# Altium project 584689669.PrjPcb
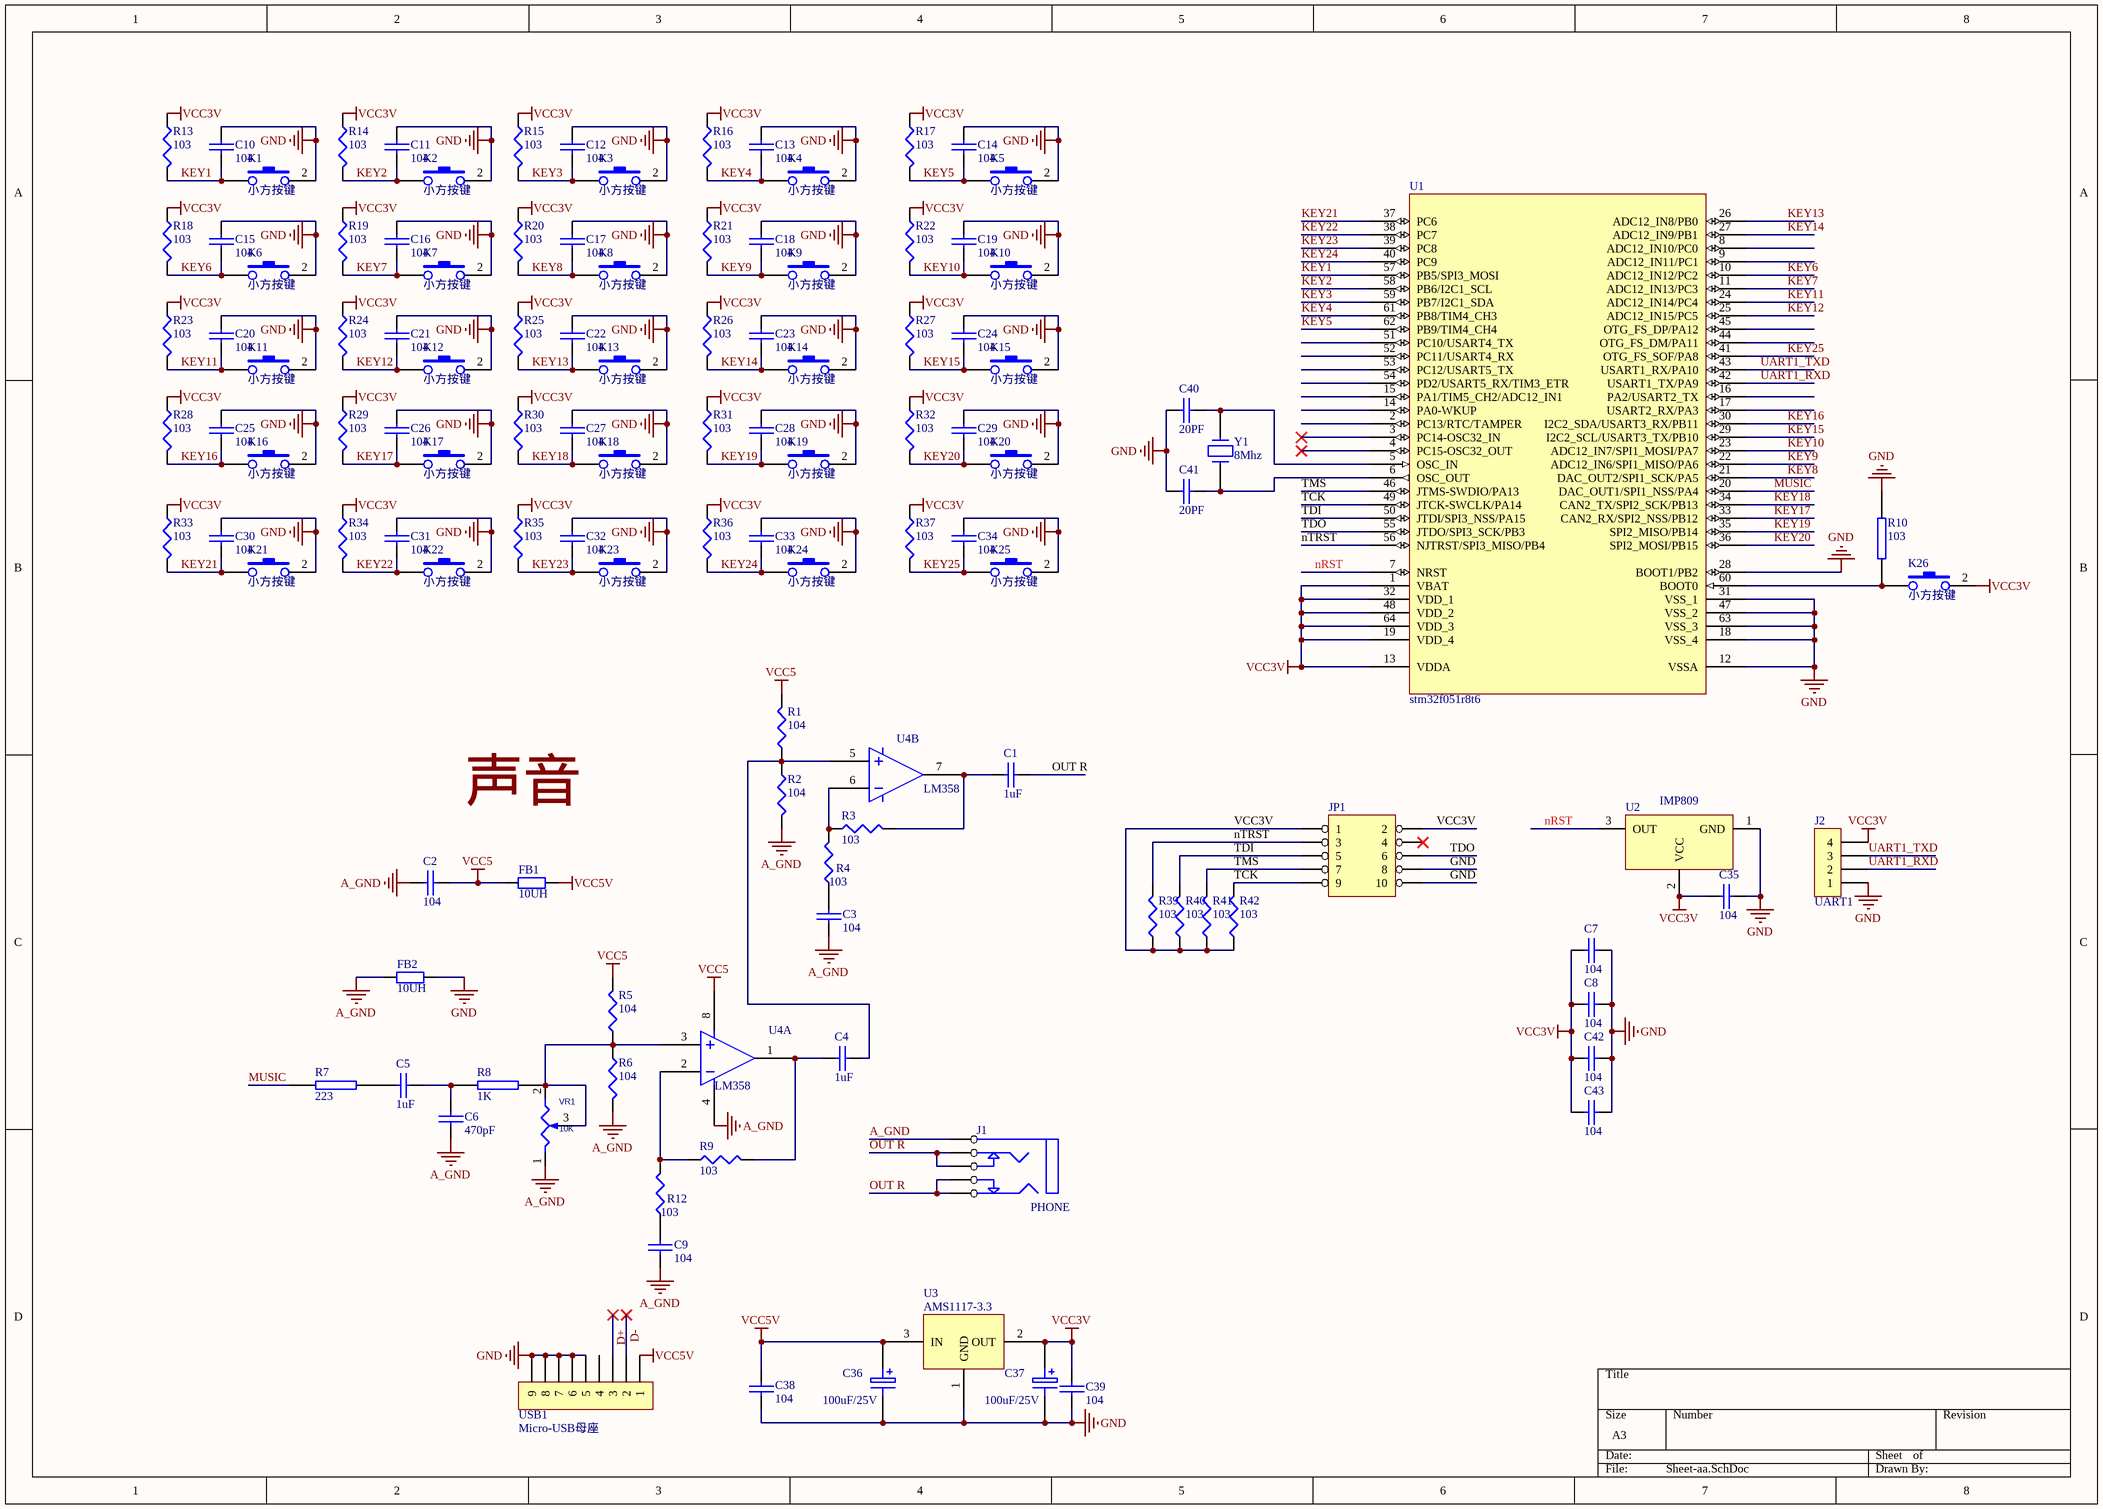
[diagram p0: Sheet-aa.SchDoc]
1 sheet, 121 parts. Net scope: global (net labels, ports and power ports of the same name join across sheets).
Board file: 584689669.PcbDoc

## Sheet Sheet-aa.SchDoc
size A3

### Parts
C1  1uF  [0805C]
C2  104  [0805C]
C3  104  [0805C]
C4  1uF  [0805C]
C5  1uF  [0805C]
C6  470pF  [0805C]
C7  104  [0805C]
C8  104  [0805C]
C9  104  [0805C]
C10  104  [0805C]
C11  104  [0805C]
C12  104  [0805C]
C13  104  [0805C]
C14  104  [0805C]
C15  104  [0805C]
C16  104  [0805C]
C17  104  [0805C]
C18  104  [0805C]
C19  104  [0805C]
C20  104  [0805C]
C21  104  [0805C]
C22  104  [0805C]
C23  104  [0805C]
C24  104  [0805C]
C25  104  [0805C]
C26  104  [0805C]
C27  104  [0805C]
C28  104  [0805C]
C29  104  [0805C]
C30  104  [0805C]
C31  104  [0805C]
C32  104  [0805C]
C33  104  [0805C]
C34  104  [0805C]
C35  104  [0805C]
C36  100uF/25V  [1016V]
C37  100uF/25V  [1016V]
C38  104  [0805C]
C39  104  [0805C]
C40  20PF  [0805C]
C41  20PF  [0805C]
C42  104  [0805C]
C43  104  [0805C]
FB1  value 10UH  [0805]  (hidden comment: Res2)
FB2  value 10UH  [0805]  (hidden comment: Res2)
J1  PHONE  [SOUND-2]
J2  UART1  [4SIP4]
JP1  (no value)  [JYNJ_10]
K1  小方按键  [4KEY-1]
K2  小方按键  [4KEY-1]
K3  小方按键  [4KEY-1]
K4  小方按键  [4KEY-1]
K5  小方按键  [4KEY-1]
K6  小方按键  [4KEY-1]
K7  小方按键  [4KEY-1]
K8  小方按键  [4KEY-1]
K9  小方按键  [4KEY-1]
K10  小方按键  [4KEY-1]
K11  小方按键  [4KEY-1]
K12  小方按键  [4KEY-1]
K13  小方按键  [4KEY-1]
K14  小方按键  [4KEY-1]
K15  小方按键  [4KEY-1]
K16  小方按键  [4KEY-1]
K17  小方按键  [4KEY-1]
K18  小方按键  [4KEY-1]
K19  小方按键  [4KEY-1]
K20  小方按键  [4KEY-1]
K21  小方按键  [4KEY-1]
K22  小方按键  [4KEY-1]
K23  小方按键  [4KEY-1]
K24  小方按键  [4KEY-1]
K25  小方按键  [4KEY-1]
K26  小方按键  [4KEY-1]
R1  104  [0805R]
R2  104  [0805R]
R3  103  [0805R]
R4  103  [0805R]
R5  104  [0805R]
R6  104  [0805R]
R7  223  [0805R]
R8  1K  [0805R]
R9  103  [0805R]
R10  103  [0805R]
R12  103  [0805R]
R13  103  [0805R]
R14  103  [0805R]
R15  103  [0805R]
R16  103  [0805R]
R17  103  [0805R]
R18  103  [0805R]
R19  103  [0805R]
R20  103  [0805R]
R21  103  [0805R]
R22  103  [0805R]
R23  103  [0805R]
R24  103  [0805R]
R25  103  [0805R]
R26  103  [0805R]
R27  103  [0805R]
R28  103  [0805R]
R29  103  [0805R]
R30  103  [0805R]
R31  103  [0805R]
R32  103  [0805R]
R33  103  [0805R]
R34  103  [0805R]
R35  103  [0805R]
R36  103  [0805R]
R37  103  [0805R]
R39  103  [0805R]
R40  103  [0805R]
R41  103  [0805R]
R42  103  [0805R]
U1  stm32f051r8t6  [LC-LQFP-64_10x10x05P]
U2  IMP809  [SOT23]
U3  AMS1117-3.3  [to-252]
U4  LM358  [SOP8]  (parts A,B of 4)
USB1  Micro-USB母座  [Micro-USB]
VR1  10K  [VR8]
Y1  8Mhz  [2XTAL]

### Nets
A_GND: C2.1 C3.1 C6.1 C9.1 FB2.1 J1.5(E) R2.2 R6.2 U4.4 VR1.1(A)
GND: C7.2 C8.2 C10.1 C11.1 C12.1 C13.1 C14.1 C15.1 C16.1 C17.1 C18.1 C19.1 C20.1 C21.1 C22.1 C23.1 C24.1 C25.1 C26.1 C27.1 C28.1 C29.1 C30.1 C31.1 C32.1 C33.1 C34.1 C35.2 C36.2 C37.2 C38.2 C39.2 C40.2 C41.1 C42.2 C43.2 FB2.2 J2.1 JP1.8 JP1.10 K1.2 K2.2 K3.2 K4.2 K5.2 K6.2 K7.2 K8.2 K9.2 K10.2 K11.2 K12.2 K13.2 K14.2 K15.2 K16.2 K17.2 K18.2 K19.2 K20.2 K21.2 K22.2 K23.2 K24.2 K25.2 R10.2 U1.12(VSSA) U1.18(VSS_4) U1.28(BOOT1/PB2) U1.31(VSS_1) U1.47(VSS_2) U1.63(VSS_3) U2.1(GND) U3.1(GND) USB1.5 USB1.6 USB1.7 USB1.8 USB1.9
VCC3V: C7.1 C8.1 C35.1 C37.1 C39.1 C42.1 C43.1 J2.4 JP1.1 JP1.2 K26.2 R13.1 R14.1 R15.1 R16.1 R17.1 R18.1 R19.1 R20.1 R21.1 R22.1 R23.1 R24.1 R25.1 R26.1 R27.1 R28.1 R29.1 R30.1 R31.1 R32.1 R33.1 R34.1 R35.1 R36.1 R37.1 R39.1 R40.1 R41.1 R42.1 U1.1(VBAT) U1.13(VDDA) U1.19(VDD_4) U1.32(VDD_1) U1.48(VDD_2) U1.64(VDD_3) U2.2(VCC) U3.2(OUT)
VCC5: C2.2 FB1.1 R1.2 R5.2 U4.8(VCC)
VCC5V: C36.1 C38.1 FB1.2 U3.3(IN) USB1.1
D+: USB1.3
D-: USB1.2
KEY1: C10.2 K1.1 R13.2 U1.57(PB5/SPI3_MOSI)
KEY2: C11.2 K2.1 R14.2 U1.58(PB6/I2C1_SCL)
KEY3: C12.2 K3.1 R15.2 U1.59(PB7/I2C1_SDA)
KEY4: C13.2 K4.1 R16.2 U1.61(PB8/TIM4_CH3)
KEY5: C14.2 K5.1 R17.2 U1.62(PB9/TIM4_CH4)
KEY6: C15.2 K6.1 R18.2 U1.10(ADC12_IN12/PC2)
KEY7: C16.2 K7.1 R19.2 U1.11(ADC12_IN13/PC3)
KEY8: C17.2 K8.1 R20.2 U1.21(DAC_OUT2/SPI1_SCK/PA5)
KEY9: C18.2 K9.1 R21.2 U1.22(ADC12_IN6/SPI1_MISO/PA6)
KEY10: C19.2 K10.1 R22.2 U1.23(ADC12_IN7/SPI1_MOSI/PA7)
KEY11: C20.2 K11.1 R23.2 U1.24(ADC12_IN14/PC4)
KEY12: C21.2 K12.1 R24.2 U1.25(ADC12_IN15/PC5)
KEY13: C22.2 K13.1 R25.2 U1.26(ADC12_IN8/PB0)
KEY14: C23.2 K14.1 R26.2 U1.27(ADC12_IN9/PB1)
KEY15: C24.2 K15.1 R27.2 U1.29(I2C2_SCL/USART3_TX/PB10)
KEY16: C25.2 K16.1 R28.2 U1.30(I2C2_SDA/USART3_RX/PB11)
KEY17: C26.2 K17.1 R29.2 U1.33(CAN2_RX/SPI2_NSS/PB12)
KEY18: C27.2 K18.1 R30.2 U1.34(CAN2_TX/SPI2_SCK/PB13)
KEY19: C28.2 K19.1 R31.2 U1.35(SPI2_MISO/PB14)
KEY20: C29.2 K20.1 R32.2 U1.36(SPI2_MOSI/PB15)
KEY21: C30.2 K21.1 R33.2 U1.37(PC6)
KEY22: C31.2 K22.1 R34.2 U1.38(PC7)
KEY23: C32.2 K23.1 R35.2 U1.39(PC8)
KEY24: C33.2 K24.1 R36.2 U1.40(PC9)
KEY25: C34.2 K25.1 R37.2 U1.41(OTG_FS_SOF/PA8)
MUSIC: R7.1 U1.20(DAC_OUT1/SPI1_NSS/PA4)
nRST: U1.7(NRST) U2.3(OUT)
nTRST: JP1.3 R39.2 U1.56(NJTRST/SPI3_MISO/PB4)
OUT R: C1.1 J1.1(A) J1.2(B) J1.3(C) J1.4(D)
TCK: JP1.9 R42.2 U1.49(JTCK-SWCLK/PA14)
TDI: JP1.5 R40.2 U1.50(JTDI/SPI3_NSS/PA15)
TDO: JP1.6 U1.55(JTDO/SPI3_SCK/PB3)
TMS: JP1.7 R41.2 U1.46(JTMS-SWDIO/PA13)
UART1_RXD: J2.2 U1.42(USART1_TX/PA9)
UART1_TXD: J2.3 U1.43(USART1_RX/PA10)
NetC1_2: C1.2 R3.2 U4.7
NetC3_2: C3.2 R4.1
NetC4_1: C4.1 R1.1 R2.1 U4.5
NetC4_2: C4.2 R9.2 U4.1
NetC5_1: C5.1 C6.2 R8.1
NetC5_2: C5.2 R7.2
NetC9_2: C9.2 R12.1
NetC40_1: C40.1 U1.5(OSC_IN) Y1.2
NetC41_2: C41.2 U1.6(OSC_OUT) Y1.1
NetK26_1: K26.1 R10.1 U1.60(BOOT0)
NetR3_1: R3.1 R4.2 U4.6
NetR5_1: R5.1 R6.1 R8.2 U4.3 VR1.2(WIPER) VR1.3(B)
NetR9_1: R9.1 R12.2 U4.2

Not connected (* = marked no-connect by the designer): JP1 4*; U1 2(PC13/RTC/TAMPER) 3(PC14-OSC32_IN)* 4(PC15-OSC32_OUT)* 8(ADC12_IN10/PC0) 9(ADC12_IN11/PC1) 14(PA0-WKUP) 15(PA1/TIM5_CH2/ADC12_IN1) 16(PA2/USART2_TX) 17(USART2_RX/PA3) 44(OTG_FS_DM/PA11) 45(OTG_FS_DP/PA12) 51(PC10/USART4_TX) 52(PC11/USART4_RX) 53(PC12/USART5_TX) 54(PD2/USART5_RX/TIM3_ETR); USB1 4

### Notes on the sheet
- 声音

### Library data of the parts
C1-C6 C9-C34 C38-C41 = CAP: Capacitor
C7 C8 C35 C42 C43 = cap: Capacitor
C36 C37 = ELECTRO1: Electrolytic Capacitor
FB1 FB2 = Res2: Resistor; Published: 8-Jun-2000; LatestRevisionDate: 17-Jul-2002; LatestRevisionNote: Re-released for DXP Platform.; PackageReference: AXIAL-0.4; Publisher: Altium Limited
J1 = PHONEJACK STEREO SW
J2 = CON4: Connector
JP1 = HEADER 5X2
K1-K26 = SW-PB: 小方按键6*6
R1-R6 R9 R12-R37 R39-R42 = RES1: 直插电阻
R7 R8 R10 = RES2
U1 = STM32F105RB_1: 32位STM单片机; 版权归属: 源创客; BOM名称: 32位STM单片机; 学习资源: www.ooocke.com
U3 = LM1117
U4 = LM139
USB1 = CON9: Connector
VR1 = RESISTOR VAR: Right: 40; Bottom: 20
Y1 = CRYSTAL